# Altium schematic sheet Sheet1.SchDoc
size A4
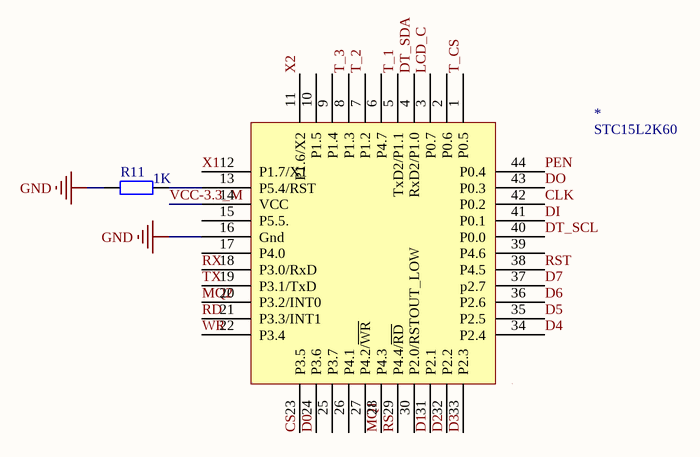
[diagram p0: Sheet1.SchDoc]

## Parts
*  STC15L2K60
R11  value 1K  [AXIAL-0.4]

## Nets
GND: *.16(Gnd) R11.1
CLK: *.42(P0.2)
CS: *.23(P3.5)
D0: *.24(P3.6)
D1: *.31(P2.1)
D2: *.32(P2.2)
D3: *.33(P2.3)
D4: *.34(P2.4)
D5: *.35(P2.5)
D6: *.36(P2.6)
D7: *.37(p2.7)
DI: *.41(P0.1)
DO: *.43(P0.3)
DT_SCL: *.40(P0.0)
DT_SDA: *.4(RxD2/P1.0)
LCD_C: *.3(P0.7)
MQ1: *.28(P4.3)
MQ2: *.20(P3.2/INT0)
PEN: *.44(P0.4)
RD: *.21(P3.3/INT1)
RS: *.29(P4.4/~{RD})
RST: *.38(P4.5)
RX: *.18(P3.0/RxD)
T_1: *.5(TxD2/P1.1)
T_2: *.7(P1.2)
T_3: *.8(P1.3)
T_CS: *.1(P0.5)
TX: *.19(P3.1/TxD)
VCC-3.3_M: *.14(VCC)
WR: *.22(P3.4)
X1: *.12(P1.7/X1)
X2: *.11(P1.6/X2)
Net*_13: *.13(P5.4/RST) R11.2

Not connected (* = marked no-connect by the designer): * 2(P0.6) 6(P4.7) 9(P1.4) 10(P1.5) 15(P5.5.) 17(P4.0) 25(P3.7) 26(P4.1) 27(P4.2/~{WR}) 30(P2.0/RSTOUT_LOW) 39(P4.6)

## Library data of the parts
* = STC15L2K60: STC15L,44pin
R11 = Res2: Resistor; Published: 8-Jun-2000; LatestRevisionDate: 17-Jul-2002; LatestRevisionNote: Re-released for DXP Platform.; PackageReference: AXIAL-0.4; Publisher: Altium Limited